# Altium schematic sheet CAN&QSPI.SchDoc: CAN & QSPI
size A4; DocumentNumber: MB1219; Revision: B.1; SheetNumber: 11; SheetTotal: 17; Project: STM32F769I-EVAL
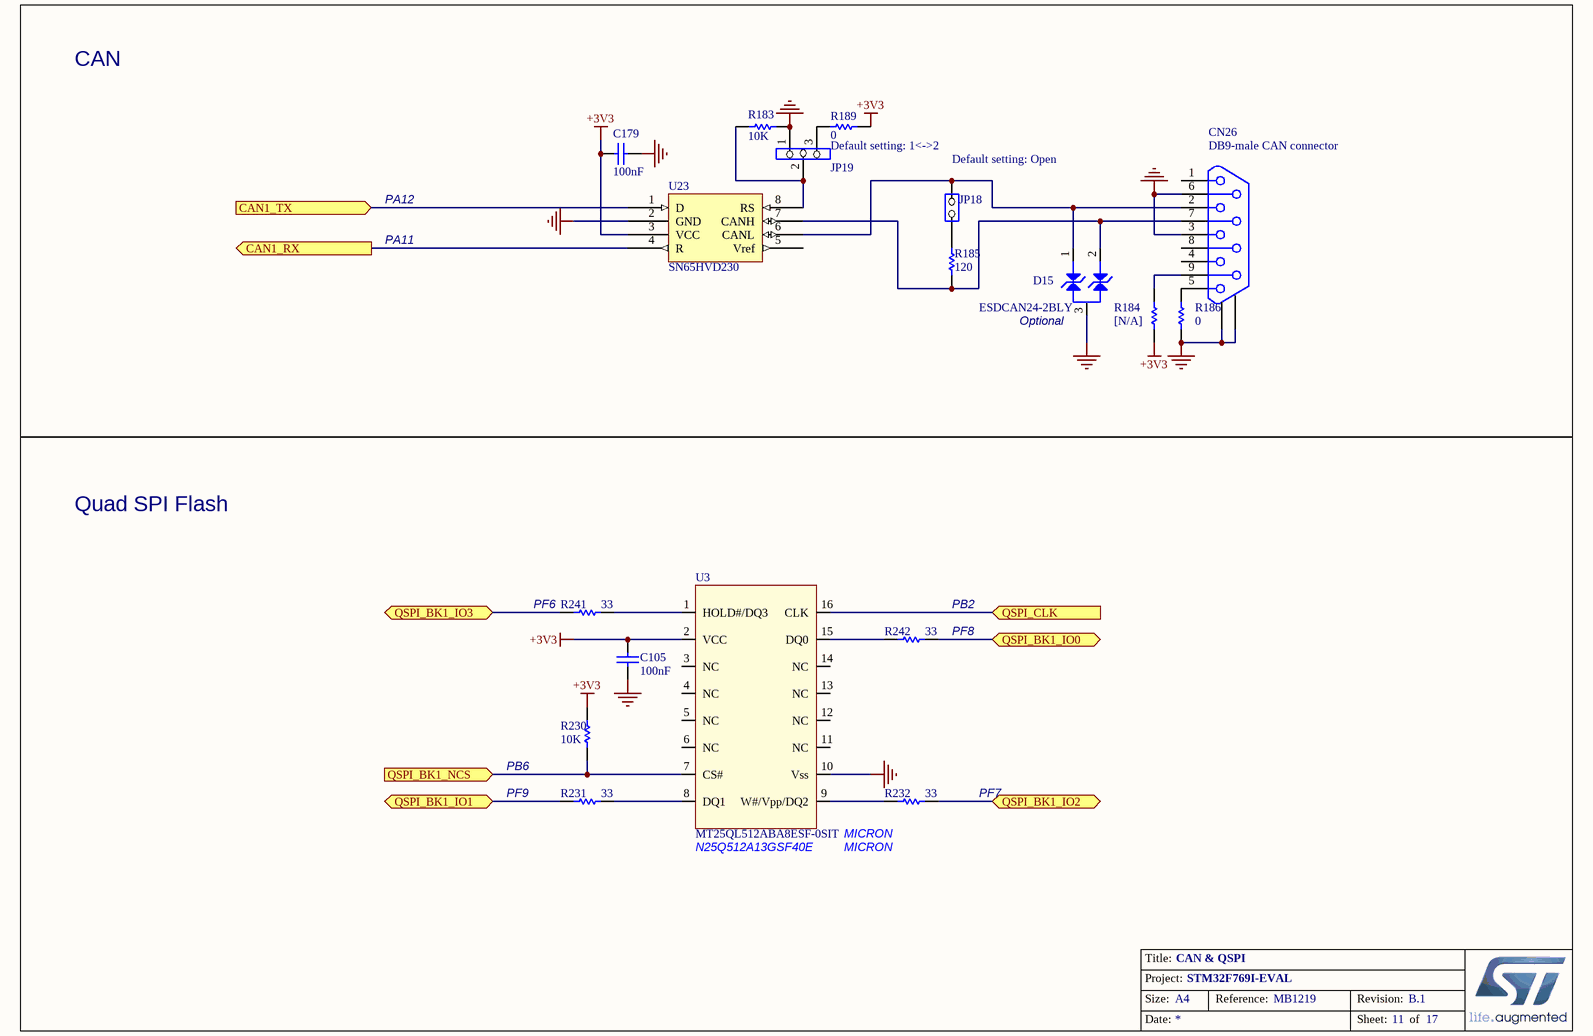
[diagram p0: CAN&QSPI.SchDoc]

## Parts
C105  100nF  [0402C]
C179  100nF  [0603C]
CN26  DB9-male CAN connector  [DB9/M]
D15  ESDCAN24-2BLY  [SOT-23]
JP18  (no value)  [SIP2]
JP19  (no value)  [SIP3]
R183  10K  [0603R]
R184  [N/A]  [0603R]
R185  120  [0603R]
R186  0  [0603R]
R189  0  [0603R]
R230  10K  [0402R]
R231  33  [0603R]
R232  33  [0603R]
R241  33  [0603R]
R242  33  [0603R]
U3  MT25QL512ABA8ESF-0SIT  [SOIC16W_1R27_10R3X10R33]
U23  SN65HVD230  [SOIC8_1R27_4R9X6]

## Ports
CAN1_RX (out), CAN1_TX (in), QSPI_BK1_IO0 (bidir), QSPI_BK1_IO1 (bidir), QSPI_BK1_IO2 (bidir), QSPI_BK1_IO3 (bidir), QSPI_BK1_NCS (in), QSPI_CLK (in)

## Nets
+3V3: C105.1 C179.1 R184.1 R189.2 R230.1 U3.2(VCC) U23.3(VCC)
GND: C105.2 C179.2 CN26.3 CN26.6 CN26.10 CN26.11 D15.3 JP19.1 R183.2 R186.1 U3.10(Vss) U23.2(GND)
CAN1_RX: U23.4(R) ; port CAN1_RX
CAN1_TX: U23.1(D) ; port CAN1_TX
QSPI_BK1_IO0: R242.1 ; port QSPI_BK1_IO0
QSPI_BK1_IO1: R231.2 ; port QSPI_BK1_IO1
QSPI_BK1_IO2: R232.1 ; port QSPI_BK1_IO2
QSPI_BK1_IO3: R241.2 ; port QSPI_BK1_IO3
QSPI_BK1_NCS: R230.2 U3.7(CS#) ; port QSPI_BK1_NCS
QSPI_CLK: U3.16(CLK) ; port QSPI_CLK
NetCN26_2: CN26.2 D15.1 JP18.2(NO) U23.6(CANL)
NetCN26_5: CN26.5 R186.2
NetCN26_7: CN26.7 D15.2 R185.1 U23.7(CANH)
NetCN26_9: CN26.9 R184.2
NetJP18_1: JP18.1(COMMON) R185.2
NetJP19_2: JP19.2 R183.1 U23.8(RS)
NetJP19_3: JP19.3 R189.1
NetR231_1: R231.1 U3.8(DQ1)
NetR232_2: R232.2 U3.9(W#/Vpp/DQ2)
NetR241_1: R241.1 U3.1(HOLD#/DQ3)
NetR242_2: R242.2 U3.15(DQ0)

Not connected (* = marked no-connect by the designer): CN26 1 4 8; U3 3(NC) 4(NC) 5(NC) 6(NC) 11(NC) 12(NC) 13(NC) 14(NC); U23 5(Vref)

## Notes on the sheet
- CAN
- Default setting: 1<->2
- (near JP18) Default setting: Open
- PA12
- PA11
- (near D15) Optional
- Quad SPI Flash
- (near R241) PF6
- (near R242) PF8
- (near R242) PB2
- PB6
- PF9
- (near U3) N25Q512A13GSF40E
- MICRON
- (near R232) PF7
- Title:
- Project:
- Size:
- Date:
- A4
- Reference:
- Sheet:
- Revision:
- of

## Library data of the parts
C105 = Cap: Capacitor; Value: 10nF; Ordered by: Subcon; Published: 8-Jun-2000; Revision: July-2002: Re-released for DXP Platform.; Publisher: Altium Limited
C179 = Cap: Capacitor; Value: 10nF; Published: 8-Jun-2000; Revision: July-2002: Re-released for DXP Platform.; Publisher: Altium Limited
CN26 = DB9-CAN
JP18 = JP2
JP19 = Jumper3
R183 R231 R232 R241 R242 = Res1: Resistor; Value: 1K; Published: 8-Jun-2000; Revision: July-2002: Re-released for DXP Platform.; Publisher: Altium Limited
R184-R186 R189 = res1: Resistor; Value: 1K; Published: 8-Jun-2000; Revision: July-2002: Re-released for DXP Platform.; Publisher: Altium Limited
R230 = res1: Resistor; Value: 1K; Ordered by: Subcon; Published: 8-Jun-2000; Revision: July-2002: Re-released for DXP Platform.; Publisher: Altium Limited
U3 = QSPI_16pins: ECCN_US/EU: 3A991
U23 = SN65HVD230D